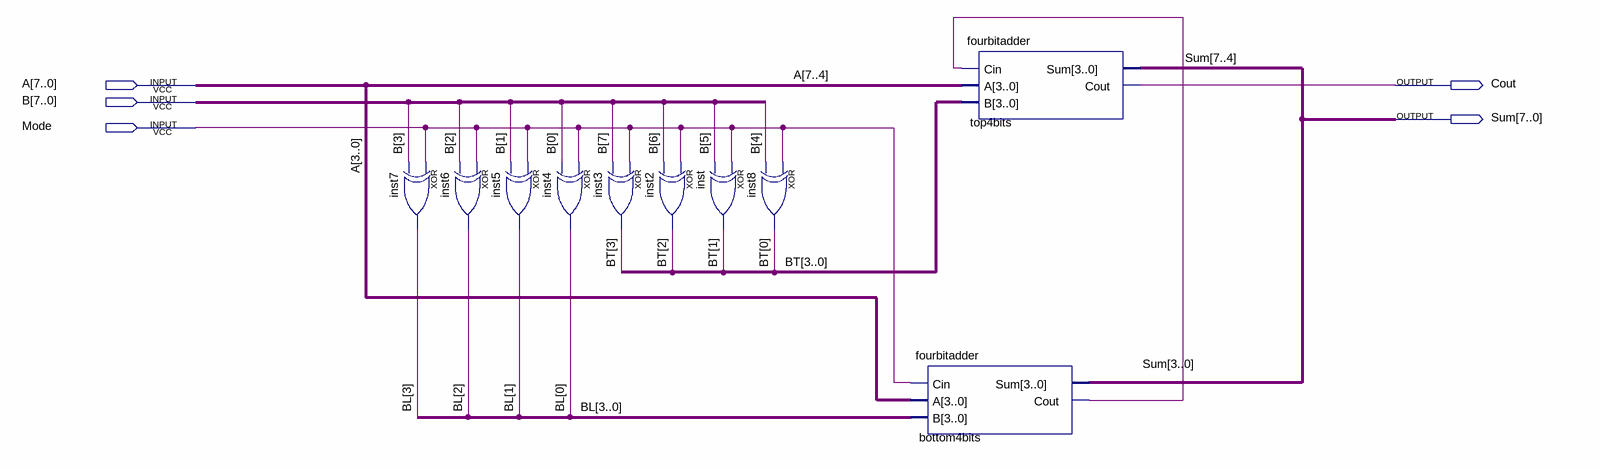
[diagram p0: schematic sheet]
// Quartus schematic 8bitadder.bdf as structural Verilog: 10 symbols, 5 pins
module \8bitadder  (
  input  [7:0] A,
  input  [7:0] B,
  input  Mode,
  output Cout,
  output [7:0] Sum
);

  wire bottom4bits_cout;
  wire [3:0] BL, BT;

  xor inst7 (BL[3], Mode, B[3]);
  xor inst5 (BL[1], Mode, B[1]);
  xor inst6 (BL[2], Mode, B[2]);
  xor inst4 (BL[0], Mode, B[0]);
  xor inst3 (BT[3], Mode, B[7]);
  xor inst (BT[1], Mode, B[5]);
  xor inst2 (BT[2], Mode, B[6]);
  xor inst8 (BT[0], Mode, B[4]);
  fourbitadder bottom4bits (.Cin(Mode), .A(A[3:0]), .B(BL), .Sum(Sum[3:0]), .Cout(bottom4bits_cout));
  fourbitadder top4bits (.Cin(bottom4bits_cout), .A(A[7:4]), .B(BT), .Sum(Sum[7:4]), .Cout(Cout));
endmodule
